# Altium project ATRACK_FACE_V1.PrjPCB
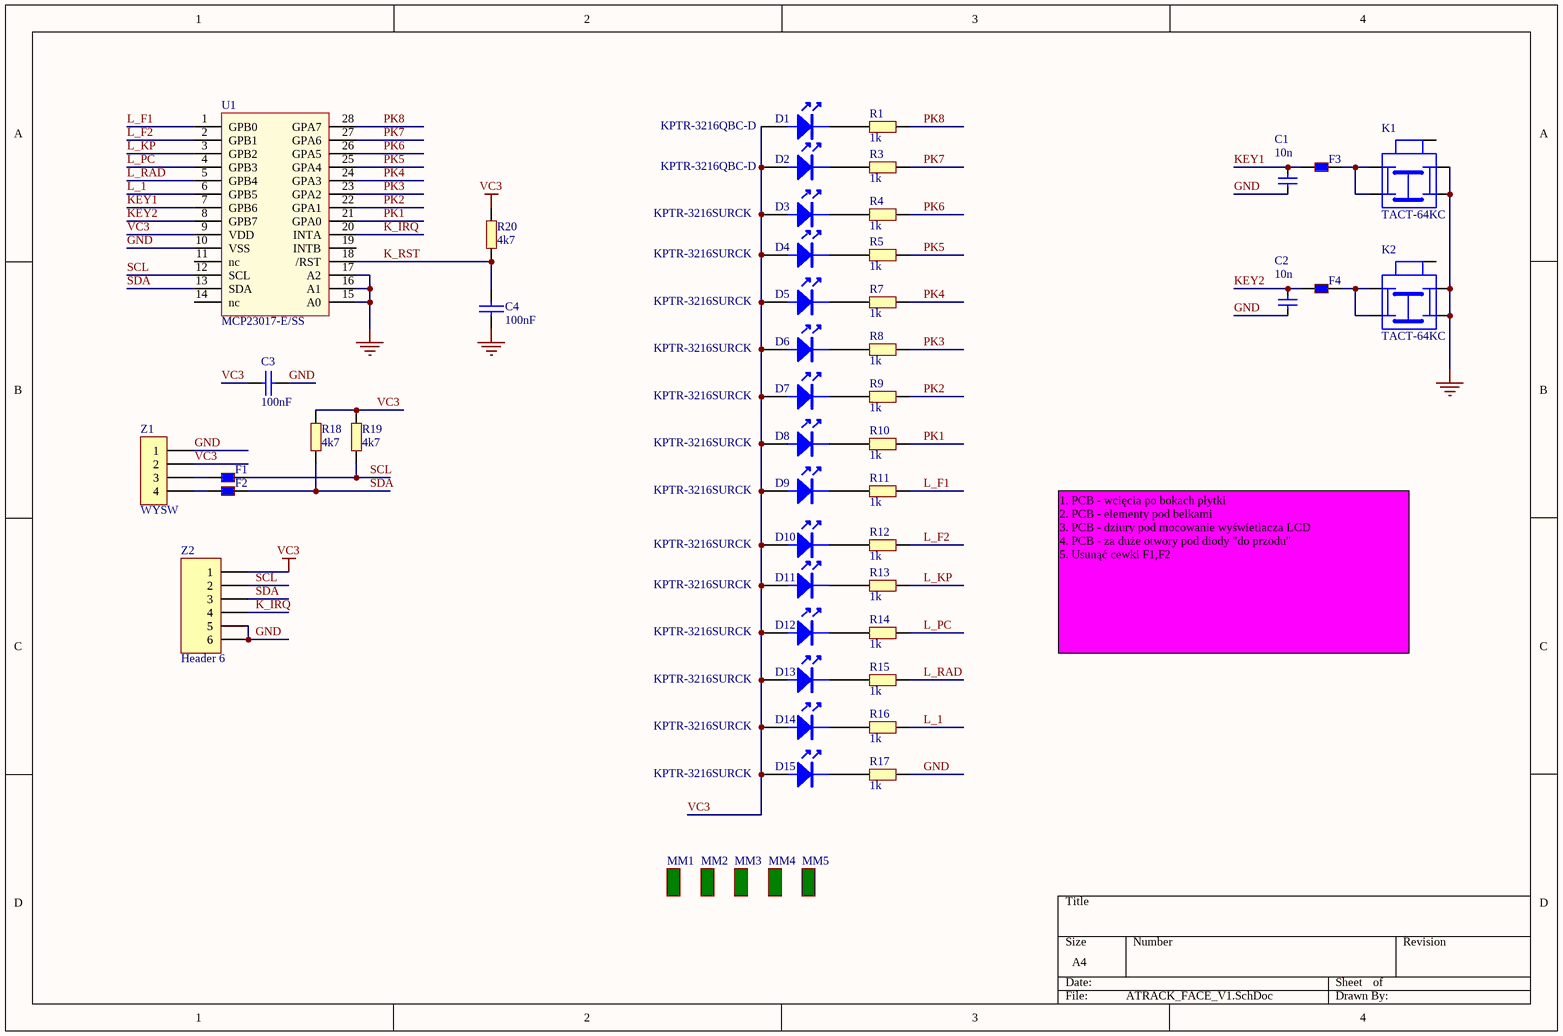
[diagram p0: ATRACK_FACE_V1.SchDoc]
1 sheet, 51 parts. Net scope: global (net labels, ports and power ports of the same name join across sheets).
Board file: ATRACK_FACE_V1.PcbDoc

## Sheet ATRACK_FACE_V1.SchDoc
size A4

### Parts
C1  10n  [0805C]
C2  10n  [0805C]
C3  100nF  [0805C]
C4  100nF  [0805C]
D1  KPTR-3216QBC-D  [LED_LAMP_1]
D2  KPTR-3216QBC-D  [LED_LAMP_1]
D3  KPTR-3216SURCK  [LED_LAMP_1]
D4  KPTR-3216SURCK  [LED_LAMP_1]
D5  KPTR-3216SURCK  [LED_LAMP_1]
D6  KPTR-3216SURCK  [LED_LAMP_1]
D7  KPTR-3216SURCK  [LED_LAMP_1]
D8  KPTR-3216SURCK  [LED_LAMP_1]
D9  KPTR-3216SURCK  [LED_LAMP_1]
D10  KPTR-3216SURCK  [LED_LAMP_1]
D11  KPTR-3216SURCK  [LED_LAMP_1]
D12  KPTR-3216SURCK  [LED_LAMP_1]
D13  KPTR-3216SURCK  [LED_LAMP_1]
D14  KPTR-3216SURCK  [LED_LAMP_1]
D15  KPTR-3216SURCK  [LED_LAMP_1]
F1  BLM18BB141SN1D  [0805L]  (value not drawn)
F2  BLM18BB141SN1D  [0805L]  (value not drawn)
F3  BLM18BB141SN1D  [0805L]  (value not drawn)
F4  BLM18BB141SN1D  [0805L]  (value not drawn)
K1  TACT-64KC  [MK_DZ]
K2  TACT-64KC  [MK_DZ]
MM1  (no value)  [REF_CIR]
MM2  (no value)  [REF_CIR]
MM3  (no value)  [REF_SQR]
MM4  (no value)  [REF_SQR]
MM5  (no value)  [PB_FREE_GRAF]
R1  1k  [0805R]
R3  1k  [0805R]
R4  1k  [0805R]
R5  1k  [0805R]
R7  1k  [0805R]
R8  1k  [0805R]
R9  1k  [0805R]
R10  1k  [0805R]
R11  1k  [0805R]
R12  1k  [0805R]
R13  1k  [0805R]
R14  1k  [0805R]
R15  1k  [0805R]
R16  1k  [0805R]
R17  1k  [0805R]
R18  4k7  [0805R]
R19  4k7  [0805R]
R20  4k7  [0805R]
U1  MCP23017-E/SS  [SSOP28]
Z1  WYSW  [SSD1306_KW]
Z2  Header 6  [UMATCH-6SMD]

### Nets
GND: C1.2 C2.2 C3.2 C4.2 K1.3 K1.4 K2.3 K2.4 R17.1 U1.10(VSS) U1.15(A0) U1.16(A1) U1.17(A2) Z1.1 Z2.5 Z2.6
VC3: C3.1 D1.A D2.A D3.A D4.A D5.A D6.A D7.A D8.A D9.A D10.A D11.A D12.A D13.A D14.A D15.A R18.1 R19.1 R20.1 U1.9(VDD) Z1.2 Z2.1
K_IRQ: U1.20(INTA) Z2.4
K_RST: C4.1 R20.2 U1.18(/RST)
KEY1: C1.1 F3.1 U1.7(GPB6)
KEY2: C2.1 F4.1 U1.8(GPB7)
L_1: R16.1 U1.6(GPB5)
L_F1: R11.1 U1.1(GPB0)
L_F2: R12.1 U1.2(GPB1)
L_KP: R13.1 U1.3(GPB2)
L_PC: R14.1 U1.4(GPB3)
L_RAD: R15.1 U1.5(GPB4)
PK1: R10.1 U1.21(GPA0)
PK2: R9.1 U1.22(GPA1)
PK3: R8.1 U1.23(GPA2)
PK4: R7.1 U1.24(GPA3)
PK5: R5.1 U1.25(GPA4)
PK6: R4.1 U1.26(GPA5)
PK7: R3.1 U1.27(GPA6)
PK8: R1.1 U1.28(GPA7)
SCL: F1.2 R19.2 U1.12(SCL) Z2.2
SDA: F2.2 R18.2 U1.13(SDA) Z2.3
NetD1_K: D1.K R1.2
NetD2_K: D2.K R3.2
NetD3_K: D3.K R4.2
NetD4_K: D4.K R5.2
NetD5_K: D5.K R7.2
NetD6_K: D6.K R8.2
NetD7_K: D7.K R9.2
NetD8_K: D8.K R10.2
NetD9_K: D9.K R11.2
NetD10_K: D10.K R12.2
NetD11_K: D11.K R13.2
NetD12_K: D12.K R14.2
NetD13_K: D13.K R15.2
NetD14_K: D14.K R16.2
NetD15_K: D15.K R17.2
NetF1_1: F1.1 Z1.3
NetF2_1: F2.1 Z1.4
NetF3_2: F3.2 K1.1 K1.2
NetF4_2: F4.2 K2.1 K2.2

Not connected (* = marked no-connect by the designer): K1 5; K2 5; U1 11(nc) 14(nc) 19(INTB)

### Notes on the sheet
- 1. PCB - wcięcia po bokach płytki
  2. PCB - elementy pod belkami
  3. PCB - dziury pod mocowanie wyświetlacza LCD
  4. PCB - za duże otwory pod diody "do przodu"
  5. Usunąć cewki F1,F2

### Library data of the parts
C1 C2 = CAP
C3 C4 = CAP: Capacitor
D1-D3 D10 = LED
D4-D9 D11-D15 = LED: KPTD-3216SGC
F1-F4 = KORALIK: Koralik ferrytowy
K1 K2 = KLAW5
MM1-MM5 = MECH
R1 R3-R5 R7-R20 = RES3
U1 = MCP23017_SSOP28: Dostawca: TME; Dostawca.Symbol: MCP23017-E/SS
Z1 = CON4: Connector
Z2 = Header 6: Micro Match 6; Dostawca.Symbol: AMP-7-215079-6; Dostawca: TME; LatestRevisionDate: 17-Jul-2002; LatestRevisionNote: Re-released for DXP Platform.; Publisher: Altium Limited